# Altium schematic sheet MicroMultimeter_PHONECNT_Sch.SchDoc
size A4
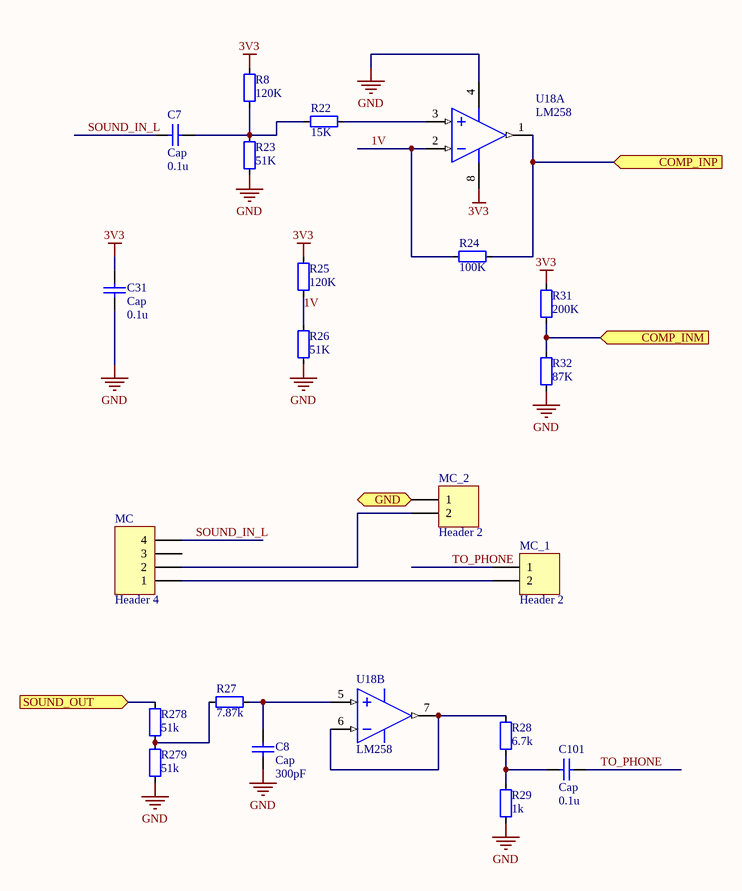
[diagram p0: MicroMultimeter_PHONECNT_Sch.SchDoc]

## Parts
C7  Cap  value 0.1u  [CAP_0603]
C8  Cap  value 300pF  [CAP_0603]
C31  Cap  value 0.1u  [CAP_0603]
C101  Cap  value 0.1u  [CAP_0603]
MC  Header 4  [microphone]
MC_1  Header 2  [HDR1X2]
MC_2  Header 2  [HDR1X2]
R8  value 120K  [RES_0603]  (hidden comment: Res_0603)
R22  value 15K  [RES_0603]  (hidden comment: Res_0603)
R23  value 51K  [RES_0603]  (hidden comment: Res_0603)
R24  value 100K  [RES_0603]  (hidden comment: Res_0603)
R25  value 120K  [RES_0603]  (hidden comment: Res_0603)
R26  value 51K  [RES_0603]  (hidden comment: Res_0603)
R27  value 7.87k  [RES_0603]  (hidden comment: Res_0603)
R28  value 6.7k  [RES_0603]  (hidden comment: Res_0603)
R29  value 1k  [RES_0603]  (hidden comment: Res_0603)
R31  value 200K  [RES_0603]  (hidden comment: Res_0603)
R32  value 87K  [RES_0603]  (hidden comment: Res_0603)
R278  value 51k  [RES_0603]  (hidden comment: Res_0603)
R279  value 51k  [RES_0603]  (hidden comment: Res_0603)
U18  LM258  [SOP-8]  (parts A,B of 2)

## Ports
COMP_INM (in), COMP_INP (in), GND, SOUND_OUT (in)

## Nets
3V3: C31.2 R8.2 R25.2 R31.2 U18.8(V+)
GND: C8.1 C31.1 R23.1 R26.1 R29.2 R32.1 R279.2 U18.4(V-)
1V: R24.2 R25.1 R26.2 U18.2(IN-)
COMP_INM: R31.1 R32.2 ; port COMP_INM
COMP_INP: R24.1 U18.1(OUT) ; port COMP_INP
GND: MC_2.1 ; port GND  [a separate net that carries the same name]
SOUND_IN_L: C7.1 MC.4
SOUND_OUT: R278.1 ; port SOUND_OUT
TO_PHONE: C101.2 MC_1.1
NetC7_2: C7.2 R8.1 R22.2 R23.2
NetC8_2: C8.2 R27.1 U18.5(IN+)
NetC101_1: C101.1 R28.2 R29.1
NetMC_1: MC.1 MC_1.2
NetMC_2: MC.2 MC_2.2
NetR22_1: R22.1 U18.3(IN+)
NetR27_2: R27.2 R278.2 R279.1
NetR28_1: R28.1 U18.6(IN-) U18.7(OUT)

Not connected (* = marked no-connect by the designer): MC 3

## Library data of the parts
C7 C8 C31 C101 = Cap: Capacitor; Published: 8-Jun-2000; LatestRevisionDate: 17-Jul-2002; LatestRevisionNote: Re-released for DXP Platform.; PackageReference: RAD-0.3; Publisher: Altium Limited; PackageDescription: Radial Cap, Thru-Hole; 2 Leads; 0.3 in Pin Spacing
MC = Header 4: Header, 4-Pin; LatestRevisionDate: 17-Jul-2002; LatestRevisionNote: Re-released for DXP Platform.; Publisher: Altium Limited
MC_1 MC_2 = Header 2: Header, 2-Pin; LatestRevisionDate: 17-Jul-2002; LatestRevisionNote: Re-released for DXP Platform.; Publisher: Altium Limited
R8 R22-R29 R31 R32 R278 R279 = Res_0603: Resistor
U18 = LM258: Amplifier; Text Field7: Published 8-Jun-2000